# EAGLE design testBoard (EAGLE 9.2.2)

## Sheet 1 of 3
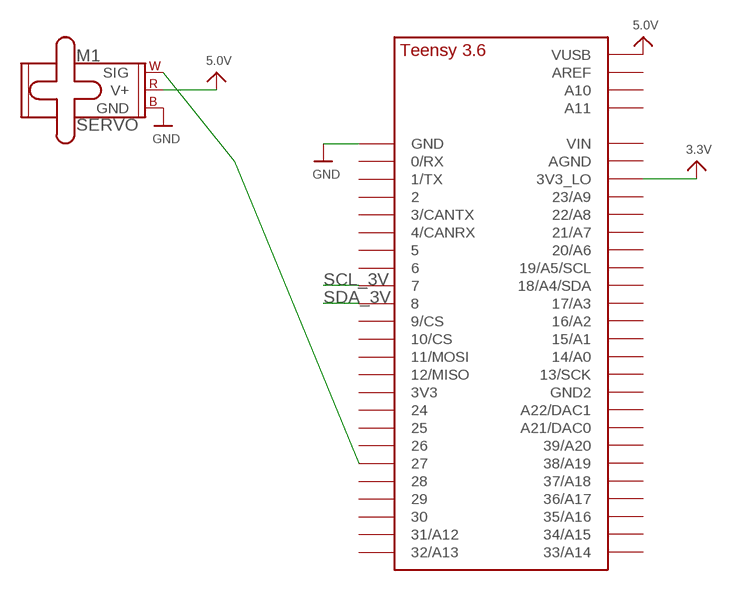
[diagram p0: schematic, sheet 1]

### Parts
M1  SERVO  [1X03]
U$69  TEENSY_3.5/3.6_BASIC  [TEENSY_3.5/3.6_BASIC]

### Nets
3.3V: U$69.3V3_LO ; also sheet 3
5.0V: M1.2(V+) U$69.VUSB ; also sheet 2
GND: M1.3(GND) U$69.GND ; also sheet 2,3
N$18: M1.1(SIG) U$69.27
SCL_3V: U$69.7 ; also sheet 3
SDA_3V: U$69.8 ; also sheet 3
Unconnected: U$69.0/RX U$69.1/TX U$69.2 U$69.3/CANTX U$69.3V3 U$69.4/CANRX U$69.5 U$69.6 U$69.9/CS U$69.10/CS U$69.11/MOSI U$69.12/MISO U$69.13/SCK U$69.14/A0 U$69.15/A1 U$69.16/A2 U$69.17/A3 U$69.18/A4/SDA U$69.19/A5/SCL U$69.20/A6 U$69.21/A7 U$69.21/DAC0(A21/DAC0) U$69.22/A8 U$69.23/A9 U$69.24 U$69.25 U$69.26 U$69.28 U$69.29 U$69.30 U$69.31/A12 U$69.32/A13 U$69.33/A14 U$69.34/A15 U$69.35/A16 U$69.36/A17 U$69.37/A18 U$69.38/A19 U$69.39/A20 U$69.A10 U$69.A11 U$69.A22/DAC1 U$69.AGND U$69.AREF U$69.GND2 U$69.VIN

## Sheet 2 of 3
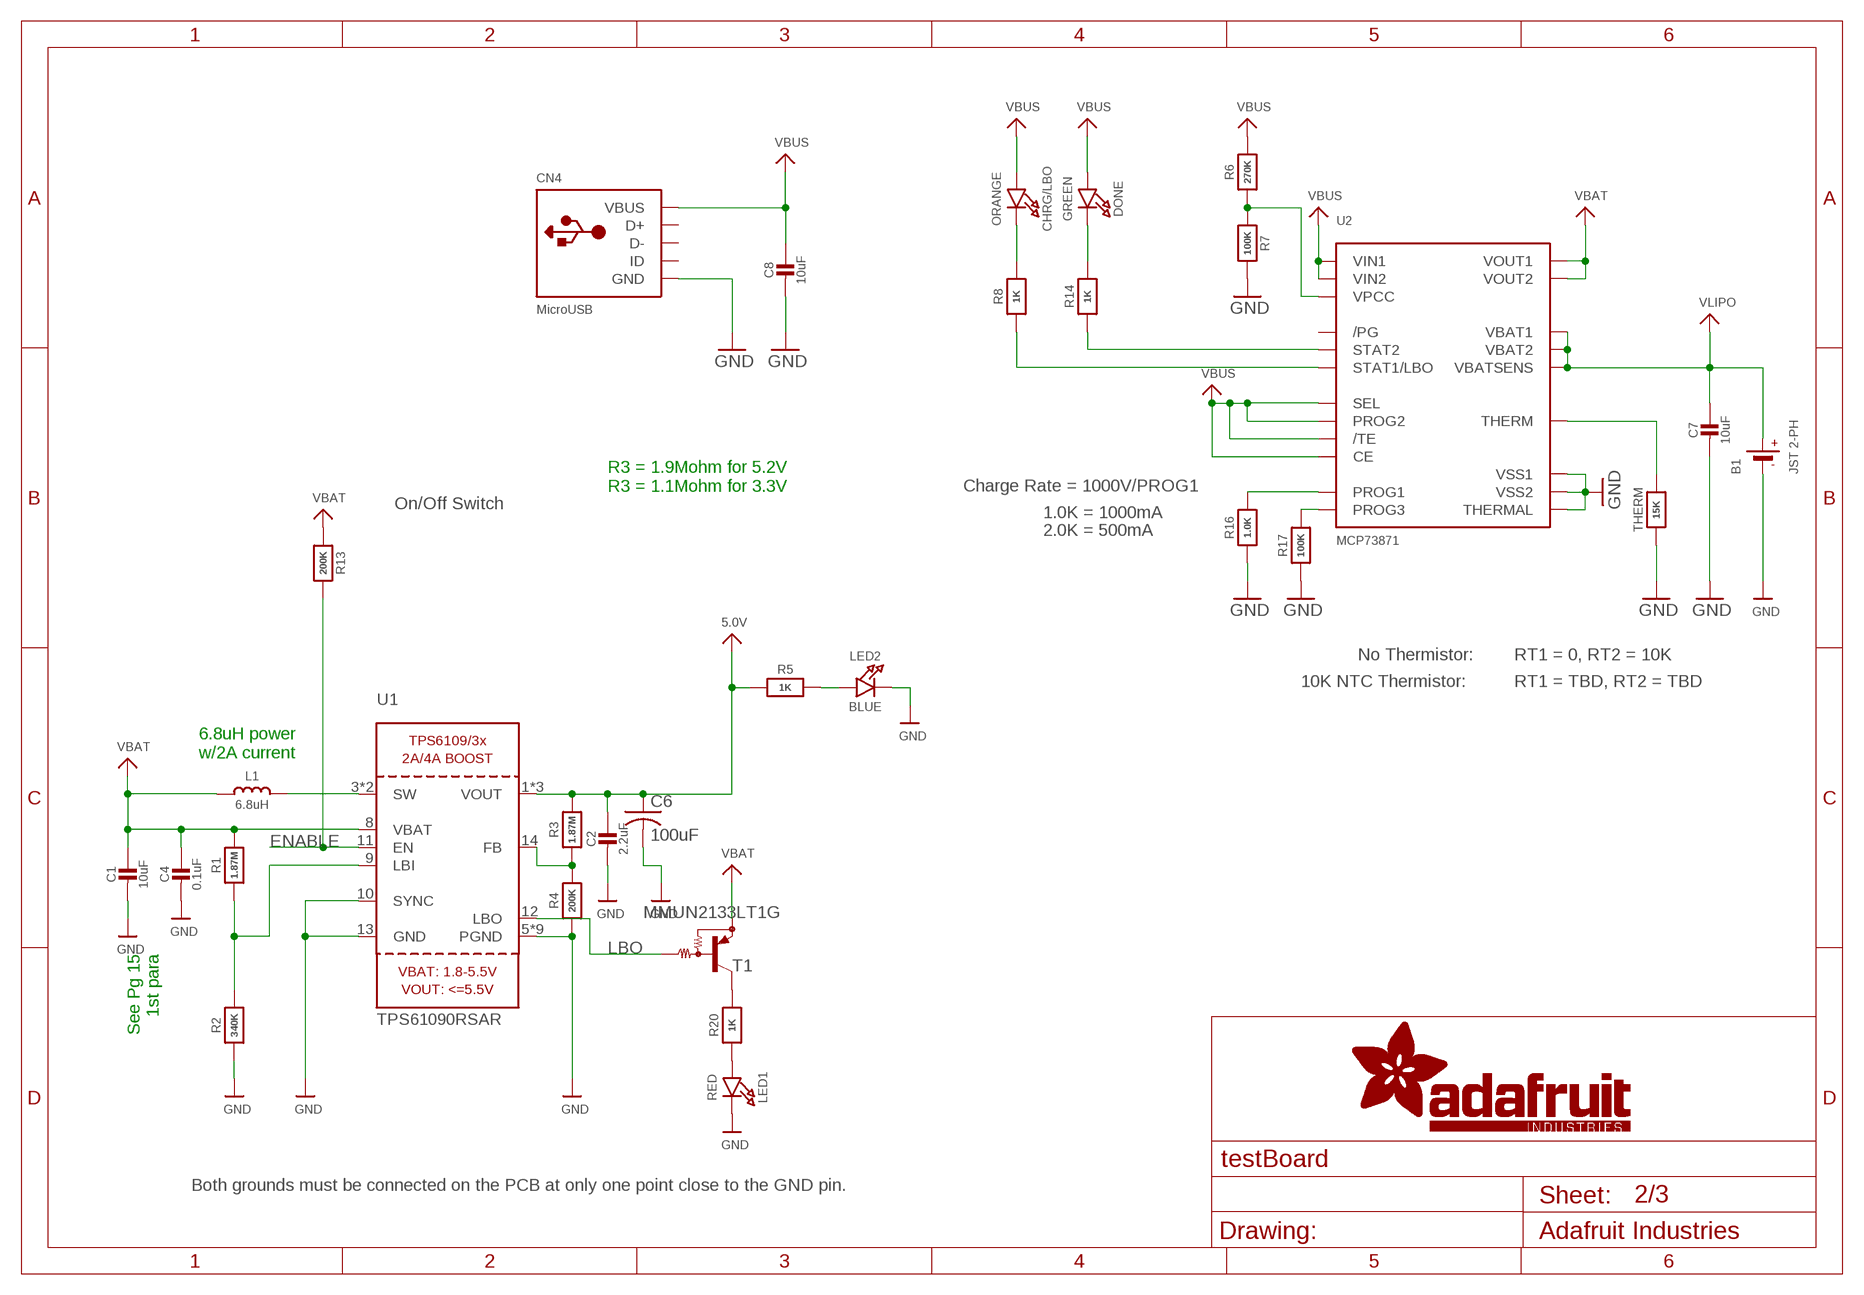
[diagram p1: schematic, sheet 2]

### Parts
B1  JST 2-PH  BATTERY  [JSTPH2]
C1  10uF  CAP_CERAMIC0805-NOOUTLINE  [0805-NO]
C2  2.2uF  CAP_CERAMIC0805-NOOUTLINE  [0805-NO]
C4  0.1uF  CAP_CERAMIC0805_10MGAP  [0805_10MGAP]
C6  100uF  C-USC1210  [C1210]
C7  10uF  CAP_CERAMIC0805-NOOUTLINE  [0805-NO]
C8  10uF  CAP_CERAMIC0805-NOOUTLINE  [0805-NO]
CHRG/LBO  ORANGE  LED0805_NOOUTLINE  [CHIPLED_0805_NOOUTLINE]
CN4  MicroUSB  USBMICRO_20329  [4UCONN_20329]
DONE  GREEN  LED0805_NOOUTLINE  [CHIPLED_0805_NOOUTLINE]
L1  6.8uH  INDUCTORTDK_VLC5045  [INDUCTOR_5X5MM_TDK_VLC5045]
LED1  RED  LED0805_NOOUTLINE  [CHIPLED_0805_NOOUTLINE]
LED2  BLUE  LED0805_NOOUTLINE  [CHIPLED_0805_NOOUTLINE]
R1  1.87M  RESISTOR_0805MP  [_0805MP]
R2  340K  RESISTOR_0805MP  [_0805MP]
R3  1.87M  RESISTOR0805_NOOUTLINE  [0805-NO]
R4  200K  RESISTOR0805_NOOUTLINE  [0805-NO]
R5  1K  RESISTOR0805_NOOUTLINE  [0805-NO]
R6  270K  RESISTOR0805_NOOUTLINE  [0805-NO]
R7  100K  RESISTOR0805_NOOUTLINE  [0805-NO]
R8  1K  RESISTOR0805_NOOUTLINE  [0805-NO]
R13  200K  RESISTOR0805_NOOUTLINE  [0805-NO]
R14  1K  RESISTOR0805_NOOUTLINE  [0805-NO]
R16  1.0K  RESISTOR0805_NOOUTLINE  [0805-NO]
R17  100K  RESISTOR0805_NOOUTLINE  [0805-NO]
R20  1K  RESISTOR0805_NOOUTLINE  [0805-NO]
T1  MMUN2133LT1G  MUN2114T1-PNP_DRIVER-SC59-BEC  [SC59-BEC]
THERM  15K  RESISTOR0805_NOOUTLINE  [0805-NO]
U1  TPS61090RSAR  VREG_TPS6103X  [PVQFN-16]
U2  MCP73871  [QFN20_4MM]

### Nets
5.0V: C2.1 C6.1 R3.2 R5.1 U1.1(VOUT) U1.15(VOUT) U1.16(VOUT) ; also sheet 1
ENABLE: R13.2 U1.11(EN)
GND: B1.1(-) C1.2 C2.2 C4.2 C6.2 C7.2 C8.2 CN4.BASE@1(GND) CN4.BASE@2(GND) CN4.GND CN4.SPRT@1(GND) CN4.SPRT@2(GND) CN4.SPRT@3(GND) CN4.SPRT@4(GND) LED1.C LED2.C R2.1 R4.1 R7.2 R16.1 R17.1 THERM.1 U1.5(PGND) U1.6(PGND) U1.7(PGND) U1.10(SYNC) U1.13(GND) U1.P$18(PGND) U1.P$19(PGND) U1.P$20(PGND) U1.P$21(PGND) U1.P$22(PGND) U1.THERMAL(PGND) U2.P$10(VSS1) U2.P$11(VSS2) U2.P$21(THERMAL) ; also sheet 1,3
LBO: T1.B U1.12(LBO)
N$1: L1.P$2 U1.3(SW) U1.4(SW)
N$2: LED1.A R20.1
N$3: R1.1 R2.2 U1.9(LBI)
N$4: LED2.A R5.2
N$5: R3.1 R4.2 U1.14(FB)
N$6: R20.2 T1.C
N$7: R6.1 R7.1 U2.P$2(VPCC)
N$8: DONE.C R14.2
N$9: R14.1 U2.P$7(STAT2)
N$10: THERM.2 U2.P$5(THERM)
N$11: R8.1 U2.P$8(STAT1/LBO)
N$12: CHRG/LBO.C R8.2
N$13: R17.2 U2.P$12(PROG3)
N$16: R16.2 U2.P$13(PROG1)
VBAT: C1.1 C4.1 L1.P$1 R1.2 R13.1 T1.E U1.8(VBAT) U2.P$1(VOUT1) U2.P$20(VOUT2)
VBUS: C8.1 CHRG/LBO.A CN4.VBUS DONE.A R6.2 U2.P$3(SEL) U2.P$4(PROG2) U2.P$9(/TE) U2.P$17(CE) U2.P$18(VIN1) U2.P$19(VIN2)
VLIPO: B1.2(+) C7.1 U2.P$14(VBAT1) U2.P$15(VBAT2) U2.P$16(VBATSENS)
Unconnected: CN4.D+ CN4.D- CN4.ID U2.P$6(/PG)

### Notes on the sheet
- R3 = 1.9Mohm for 5.2V
  R3 = 1.1Mohm for 3.3V
- Charge Rate = 1000V/PROG1
- On/Off Switch
- 1.0K = 1000mA
- 2.0K = 500mA
- No Thermistor: | RT1 = 0, RT2 = 10K
- 10K NTC Thermistor: | RT1 = TBD, RT2 = TBD
- 6.8uH power
  w/2A current
- See Pg 15
  1st para
- Both grounds must be connected on the PCB at only one point close to the GND pin.

## Sheet 3 of 3
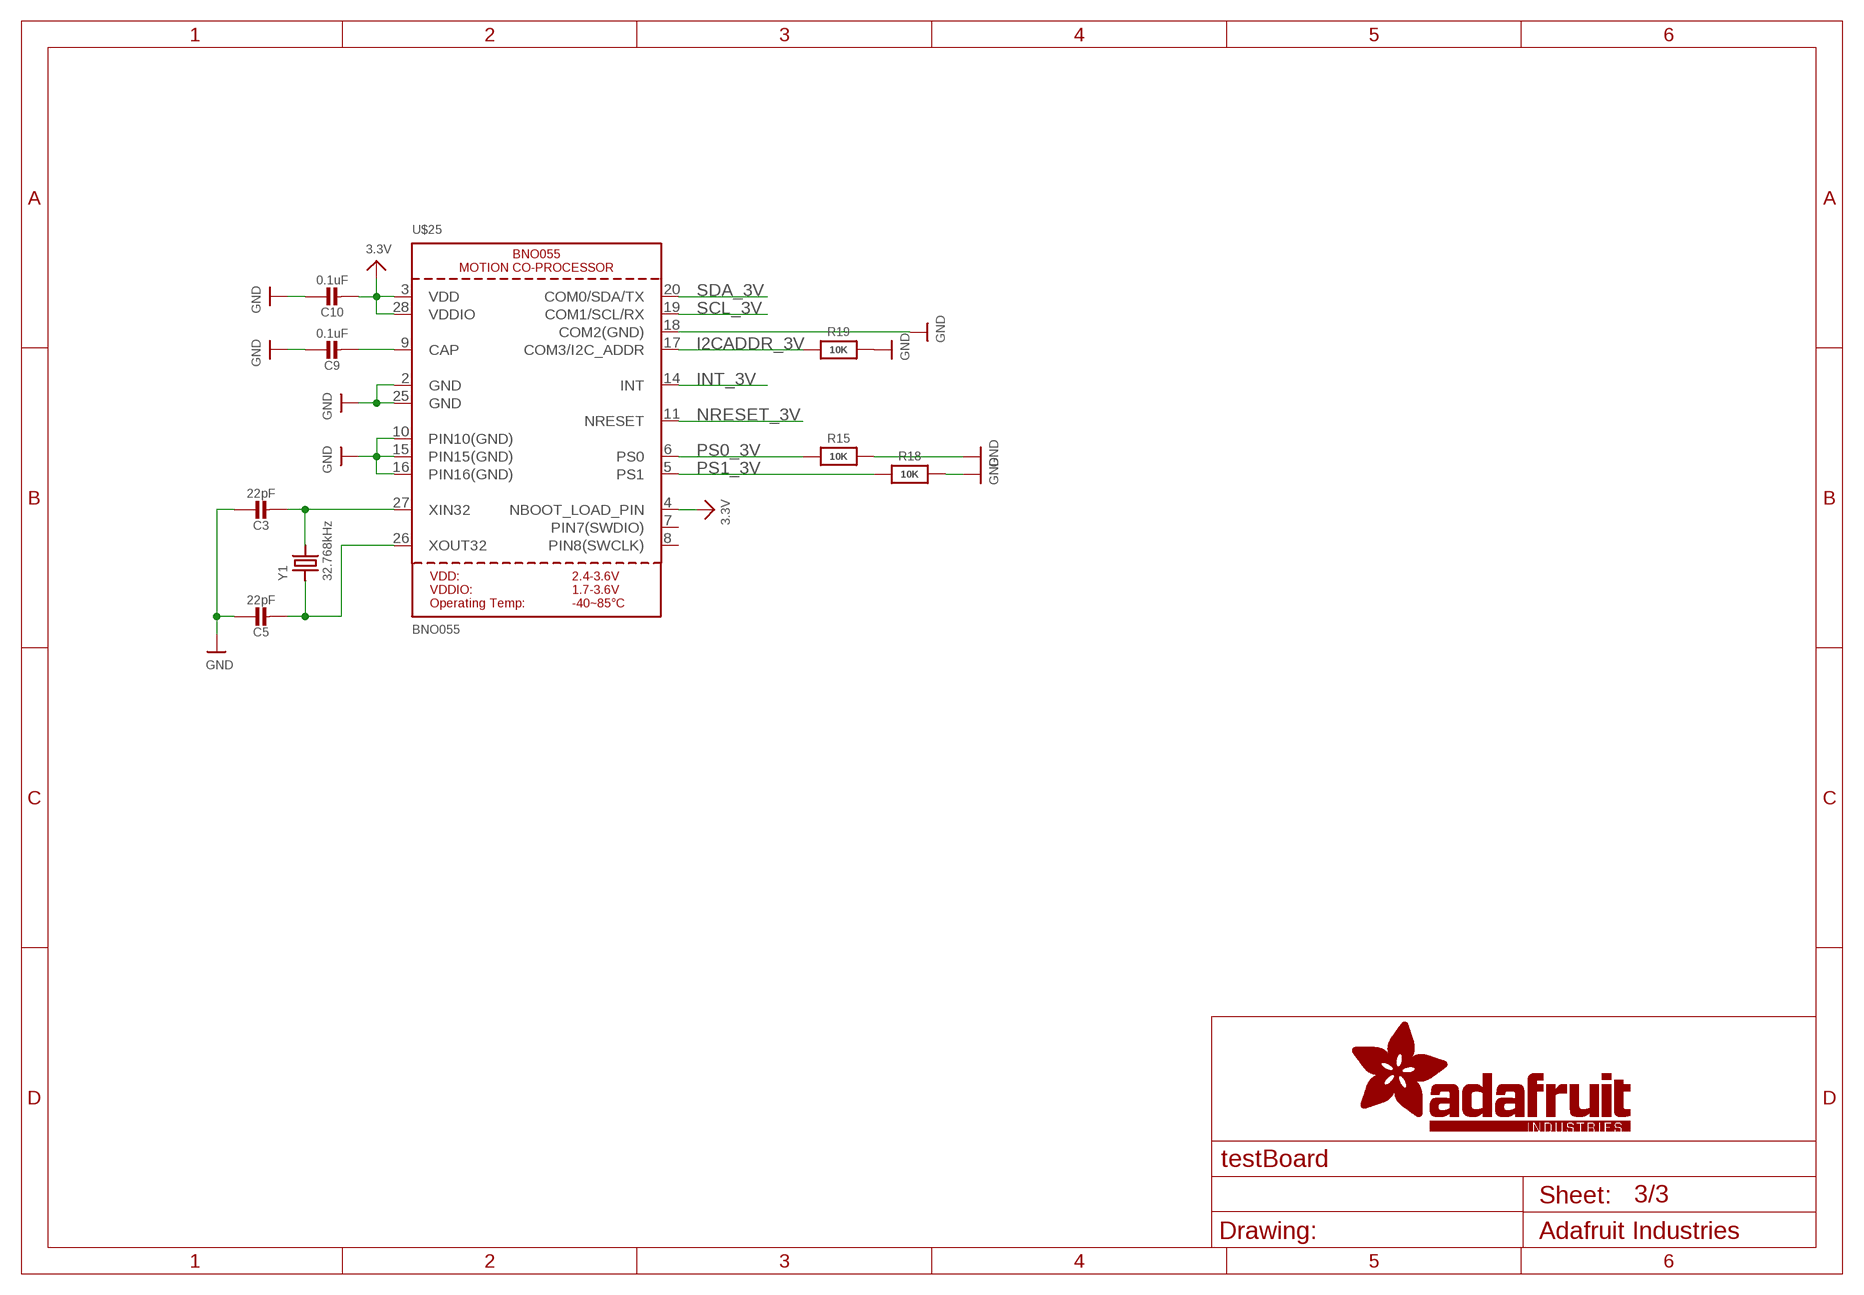
[diagram p2: schematic, sheet 3]

### Parts
C3  22pF  CAP_CERAMIC0805-NOOUTLINE  [0805-NO]
C5  22pF  CAP_CERAMIC0805-NOOUTLINE  [0805-NO]
C9  0.1uF  CAP_CERAMIC0805-NOOUTLINE  [0805-NO]
C10  0.1uF  CAP_CERAMIC0805_10MGAP  [0805_10MGAP]
R15  10K  RESISTOR0805_NOOUTLINE  [0805-NO]
R18  10K  RESISTOR0805_NOOUTLINE  [0805-NO]
R19  10K  RESISTOR0805_NOOUTLINE  [0805-NO]
U$25  BNO055  [BNO055]
Y1  32.768kHz  CRYSTAL8.0X3.8  [CRYSTAL_8X3.8]

### Nets
3.3V: C10.2 U$25.3(VDD) U$25.4(NBOOT_LOAD_PIN) U$25.28(VDDIO) ; also sheet 1
GND: C3.1 C5.1 C9.1 C10.1 R15.2 R18.2 R19.2 U$25.2(GND) U$25.10(PIN10(GND)) U$25.15(PIN15(GND)) U$25.16(PIN16(GND)) U$25.18(COM2(GND)) U$25.25(GND) ; also sheet 1,2
I2CADDR_3V: R19.1 U$25.17(COM3/I2C_ADDR)
INT_3V: U$25.14(INT)
N$14: C3.2 U$25.27(XIN32) Y1.P$4
N$15: C5.2 U$25.26(XOUT32) Y1.P$1
N$17: C9.2 U$25.9(CAP)
NRESET_3V: U$25.11(NRESET)
PS0_3V: R15.1 U$25.6(PS0)
PS1_3V: R18.1 U$25.5(PS1)
SCL_3V: U$25.19(COM1/SCL/RX) ; also sheet 1
SDA_3V: U$25.20(COM0/SDA/TX) ; also sheet 1
Unconnected: U$25.7(PIN7(SWDIO)) U$25.8(PIN8(SWCLK))

## Library data of the parts
B1 = microbuilder:BATTERY: CR1220 SMT - Digikey: 3001K-ND CD2032 BAT-HLD-001 - Digikey: BAT-HLD-001-ND
C1-C5 C7-C10 = microbuilder:CAP_CERAMIC: Ceramic Capacitors For new designs, use the packages preceded by an '_' character since they are more reliable: The following footprints should be used on most boards: _0402 - Standard footprint for regular board layouts _0603 - Standard footprint for regular board layouts _0805 - Standard footprint for regular board layouts _1206 - Standard footprint for regular board layouts For extremely tight-pitch boards where space is at a premium, the following 'micro-pitch' footprints can be used (smaller pads, no silkscreen outline, etc.): _0402MP - Micro-pitch footprint for very dense/compact boards _0603MP - Micro-pitch footprint for very dense/compact boards _0805MP - Micro-pitch footprint for very dense/compact boards _1206MP - Micro-pitch footprint for very dense/compact boards
C6 = rcl:C-US: CAPACITOR, American symbol
CHRG/LBO DONE LED1 LED2 = microbuilder:LED: LED 0603 - 0603 Surface Mount Package 2mA: Green LED - Low Power (3.9mcd, 2ma, 1.7Vf) - Digikey: 475-2709-2-ND Orange LED - Low Power (9.8mcd, 2ma, 1.8Vf) - Digikey: 475-1194-2-ND Red LED - Low Power (5mcd, 2ma, 1.8Vf) - Digikey: 475-1195-2-ND Yellow LED - Low Power (7mcd, 2ma, 1.8Vf) - Digikey: 475-1196-2-ND 5mA: Blue LED - Low Power (17mcd, 5ma, 2.9Vf) - Digikey: LNJ937W8CRACT-ND 0805 - 0805 Surface Mount Package 2mA: Red LED (8.8mcd, 2mA, 1.8Vf, Clear) - Low Power [Digikey: 475-2510-1-ND] Green LED (5mcd, 2mA, 1.8Vf, Clear) - Low Power [Digikey: 475-2730-1-ND] Yellow LED (11.3mcd, 2mA, 1.8Vf, Clear) - Low Power [Digikey: 475-2555-1-ND] 20mA: Red LED (104mcd, 20mA, Diffused) - LS R976 [Digikey: 475-1278-6-ND] Red LED (12mcd, 20mA, 2.0Vf, Clear) - APT2012EC [Digikey: 754-1128-1-ND] Green LED (15mcd, 20mA, 2.2Vf, Clear) - APT2012GC [Digikey: 754-1131-1-ND] Orange LED (160mcd, 20mA, 2.1Vf, Clear) - APT2012SECK [Digikey: 754-1130-1-ND] 1206 - 1206 Surface Mount Package Green LED (26mcd, 20mA, Diffused) - LG N971 [Digikey: 475-1407-6-ND] Red LED (15mcd, 20mA, Diffused) - LH N974 [Digikey: 475-1416-6-ND] Cree - Cree High-Power Surface Mount LEDs XPEBWT-L1-0000-00D50 - White 111lm 350mA 2.9Vf 6200K 110° XTEAWT-00-0000-00000LEE3 - White 114lm 350mA 2.85Vf 5000K 115° Everlight - Everlight 45-21 Series Surface Mount LEDs 45-21/QK2C-B2832AC2CB2/2T - Warm White 2000mcd 20mA 3.25Vf 3050K 120° 45-21/LK2C-B38452C4CB2/2T - Nuetral White 2000mcd 20mA 3.25Vf 4150K 120° 45-21/LK2C-B50634C6CB2/2T - Cold White 2200mcd 20mA 3.25Vf 5650K 120° PLCC2 Reverse Mount LS T77K-J1L2-1-0-2-R18-Z - Red 11.25mcd 2mA 1.8Vf 630nm 120° LO T77K-L1M2-24-Z - Orange 19.6mcd 2mA 1.8Vf 606nm 120° LY T77K-K2M1-26-Z - Yellow 15.7mcd 2mA 1.8Vf 587nm 120°
CN4 = microbuilder:USB: USB Connectors USBMINIB - Surface Mount Female Mini-B USB Connector 4UConnector: 06564
L1 = microbuilder:INDUCTOR: Inductors 0603: 10nH Ceramic Inductor - microwire antenna/RF (Digikey: 712-1434-2-ND) 0805: 560nH Ceramic Inductor - RF (Digikey: 553-1047-1-ND) 270nH Ceramic Inductor - Q = 40@250MHz, +-5%, 1 Ohm DC Resistance (Digikey: 535-10506-2-ND) 1007 (2518 Metric) SMT: 10µH 10% 250mOhm 820mA 1007 Inductor (Digikey: 587-2189-1-ND) 22µH 10% 500mOhm 580mA 1007 Inductor (Digikey: 587-2190-1-ND) 47µH 10% 950mOhm 420mA 1007 Inductor (Digikey: 587-2191-1-ND) 47µH 5% 100mOhm 1A 1008 Inductor (Digikey: 732-1816-1-ND) 5.0x5.0mm (Taiyo Yuden NR5040 Series) 6.8µH 20% 2.3A 64mOhm Inductor (Digikey: 587-2374-2-ND) 5.0x5.0mm (TDK VLC5045 Series) 4.7µH 20% 3.3A 34mOhm Inductor (Digikey: 445-6526-1-ND) 6.8µH 20% 2.7A 46mOhm Inductor (Digikey: 445-6527-1-ND) 6.0x6.0mm (TDK VLC6045 Series) 4.7µH 20% 3.8A 27mOhm Inductor (Digikey: 445-6538-2-ND) 6.8µH 20% 3A 41mOhm Inductor (Digikey: 445-6540-1-ND) 6.2µH 30% 2.2A 45mOhm Inductor (Digikey: SRR5028-6R2YCT-ND) - Not TDK VLC6045 but footprint should match 6.0x6.0mm (TDK SLF6045 Series) 6.8uH 30% 2A 33mOhm Inductor (Digikey: 445-4572-1-ND, Mouser: 810-SLF645T6R8N2R0PF) 6.0x6.0mm (Sumida CDRH5D28 Series) 6.2uH 30% 1.8A 45mOhm Inductor (Digikey: 308-1542-1-ND) Taiyo Yuden NR3015T2R2M - 2.2uH 20% 1.5A (Digikey: 587-1648-2-ND, Mouser: 963-NR3015T2R2M) - Used with TI TPS62172 CoilCraft RFID Transponder Coil - MA5532-AE (For use with AS3935 Lightning Sensor) Vishay IHLP 1.0uH Molded Inductor - 24mOhm DCR, 5A, +/-20%, -55°C-125°C (Digikey: 541-1319-1-ND)
M1 = SparkFun-Electromechanical:SERVO: Servo Motor 3-pin connector for a standard servo motor (voltage supply, ground, and control signal.) SparkFun Products Servo - Generic (Sub-Micro Size) <https://www.sparkfun.com/products/9065> (ROB-09065) Servo - Generic High Torque Continuous Rotation (Standard Size) <https://www.sparkfun.com/products/9347> (ROB-09347) Servo - Generic High Torque (Standard Size) <https://www.sparkfun.com/products/11965> (ROB-11965)
R1-R8 R13-R20 THERM = microbuilder:RESISTOR: Resistors For new designs, use the packages preceded by an '_' character since they are more reliable: The following footprints should be used on most boards: _0402 - Standard footprint for regular board layouts _0603 - Standard footprint for regular board layouts _0805 - Standard footprint for regular board layouts _1206 - Standard footprint for regular board layouts For extremely tight-pitch boards where space is at a premium, the following 'micro-pitch' footprints can be used (smaller pads, no silkscreen outline, etc.): _0402MP - Micro-pitch footprint for very dense/compact boards _0603MP - Micro-pitch footprint for very dense/compact boards _0805MP - Micro-pitch footprint for very dense/compact boards _1206MP - Micro-pitch footprint for very dense/compact boards
T1 = transistor:*-PNP_DRIVER-: PNP Bias Resistor Transistor
U1 = microbuilder:VREG_TPS6103X: TPS6103x 4A Boost - 1.8-5.5V Input, Adjustable Output to 5.5V
U2 = microbuilder:MCP73871: MCP73871 Lithium Polymer Battery Charger Digikey: MCP73871-2CCI/ML-ND
U$25 = microbuilder:BNO055: BNO055 - Motion Co-Processor
U$69 = Teensy356:TEENSY_3.5/3.6_BASIC
Y1 = microbuilder:CRYSTAL: Crystals HC49UP - Surface Mount Crystal 4.0MHz 18pF +/-30ppm Surface Mount Crystal [Digikey: 535-9857-1-ND] 12.0 MHz Surface Mount Crystal [Digikey: 535-9869-6-ND] 25.0 MHz Surface Mount Crystal [Digikey: 535-9078-1-ND] 2.5 x 2.0mm - MEMs SMT Crystal 16.0 MHz 10pF 20ppm 2.5 x 2.0mm Crystal [Digikey -40-85°C: 535-10923-1-ND] 3.2 x 2.5mm - MEMs SMT Crystal 12.0 MHz 8pF 15ppm 3.2 x 2.5mm Crystal [Digikey: -10-70°C: 644-1047-1-ND -40-125°C: 644-1128-1-ND] 40~85°C cheaper: 644-1173-6-ND 16.0 MHz 8pF 15ppm 3.2 x 2.5mm Crystal [Digikey: -10-70°C: 644-1049-1-ND -40-125°C: 644-1129-2-ND]-40~85°C cheaper: 644-1175-6-ND 16.0 MHz 10pF 10ppm 3.2 x 2.5mm Crystal [Digikey: 644-1100-1-ND] 27.12 MHz 18pF 30ppm 3.2 x 2.5mm Crystal [Digikey: 887-1424-1-ND] 27.12MHz 10pF 10ppm 3.2 x 2.5mm Crystal [Digikey: 887-1329-1-ND] 4.9 x 1.8mm - MEMs SMT Crystal 32.768 KHz 12.5pF 20ppm 4.9 x 1.8mm Crystal [Digikey: SE2415CT-ND] 8.0 x 3.8mm - Surface Mount Crystal 32.768kHz 12.5pF 20ppm -40°C-85°C [Digikey: 535-9166-2-ND] Cylinder 32.768KHz Cylinder Crystal (2x6mm body) [Ex. Digikey: 300-8341-2-ND]

## Board
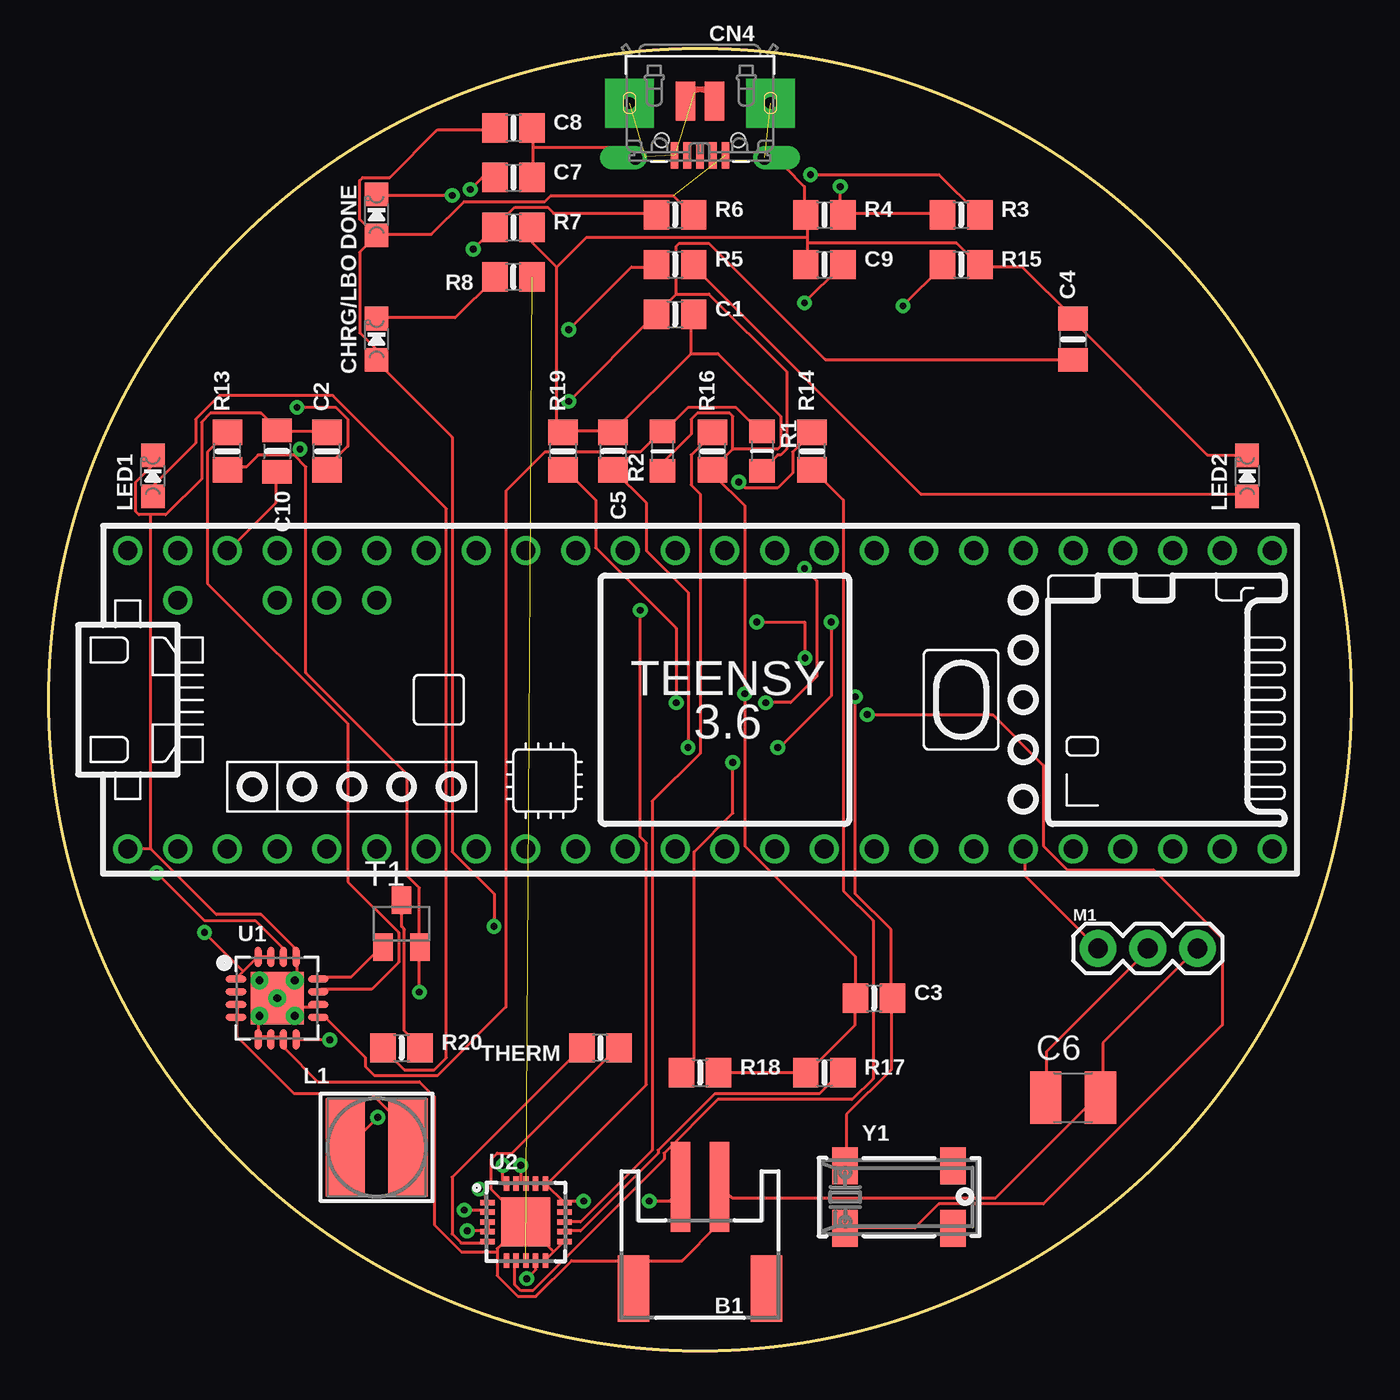
[diagram p3: board, top side]
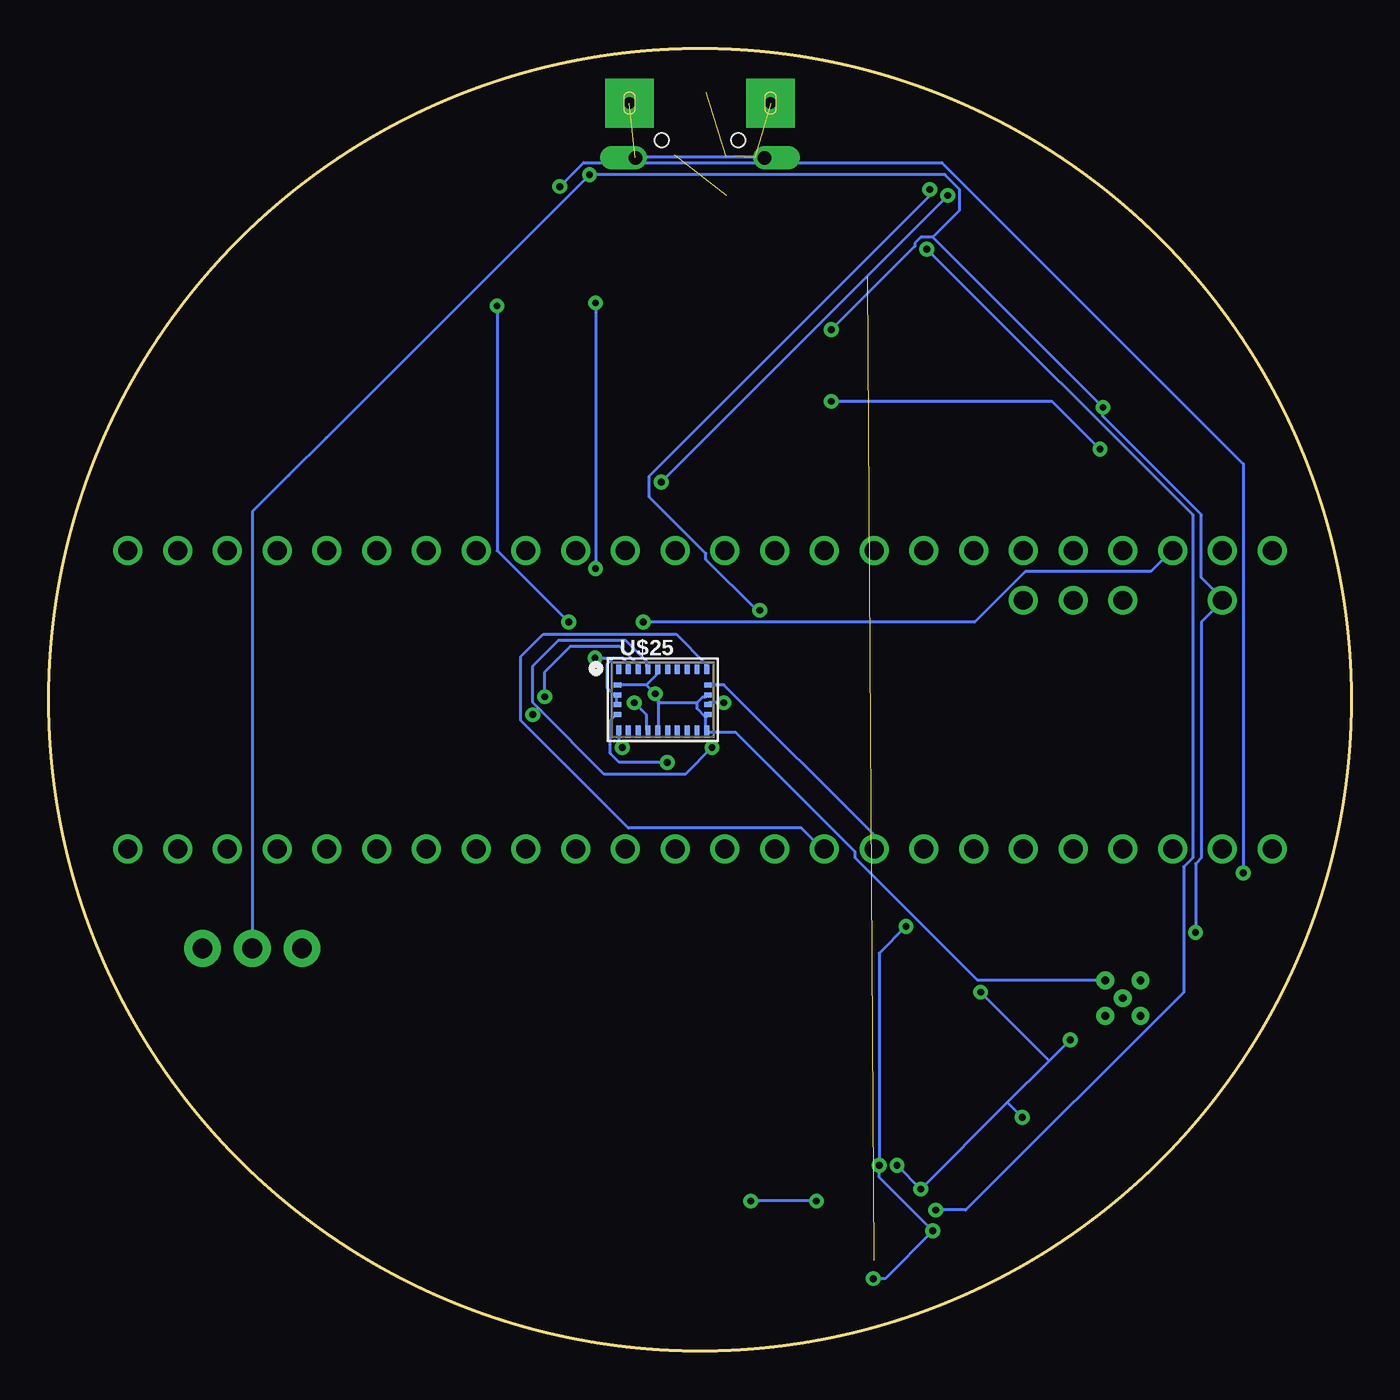
[diagram p4: board, bottom side, seen from below]

Size 66.48 x 66.48 mm. Coordinates in mm from the lower left corner, seen from the top.
Outline: circle at 33.24,33.24 radius 33.24
Copper layers (1*16): Top 0.035mm / dielectric 1.5mm / Bottom 0.035mm
Design rules "default": minimum track width 6mil, minimum drill 0.35mm, track to track 6mil, track to pad 6mil, pad to pad 6mil, via to via 6mil, smd to smd 6mil, copper to edge 40mil, drill to drill 6mil, minimum pad ring 10mil, minimum via ring 8mil, stop-mask expansion 4mil, vias tented up to drill 0mil, thermal gap 10mil

### Footprints (pad centres in the part's own frame; a part is rotated, then mirrored left to right if it is on the bottom)
JSTPH2 = smd 1 x 4.6: 1 -1,-3.7; 2 1,-3.7 | smd 1.6 x 3.4: NC1 -3.4,1.5; NC2 3.4,1.5
0805-NO = smd 1.3 x 1.5: 1 -0.95,0; 2 0.95,0
0805_10MGAP = smd 1.2 x 1.5: 1 -1.05,0; 2 1.05,0
C1210 = smd 1.6 x 2.7: 1 -1.4,0; 2 1.4,0
CHIPLED_0805_NOOUTLINE = smd 1.2 x 1.2: A 0,-1.05; C 0,1.05
4UCONN_20329 = smd 1 x 2: BASE@1 -0.75,-2; BASE@2 0.75,-2 | smd 0.4 x 1.35: D+ 0,0.775; D- -0.65,0.775; GND 1.3,0.775; ID 0.65,0.775; VBUS -1.3,0.775 | drill 0.7 offset: SPRT@1 -3.3,0.9; SPRT@2 3.3,0.9 | drill 0.6 pad 2.5 square: SPRT@3 -3.6,-1.9; SPRT@4 3.6,-1.9 | hole 0.7: -1.95,0; 1.95,0
INDUCTOR_5X5MM_TDK_VLC5045 = smd 2 x 5: P$1 -1.6,0; P$2 1.6,0
1X03 = drill 1.016 pad 1.88: 1 0,0; 2 2.54,0; 3 5.08,0
_0805MP = smd 1.2 x 1.3: 1 -1.016,0; 2 1.016,0
SC59-BEC = smd 1 x 1.4: B -0.95,-1.2; C 0,1.2; E 0.95,-1.2
PVQFN-16 = smd 1.05 x 0.35: 1 -2.1,0.975; 2 -2.1,0.325; 3 -2.1,-0.325; 4 -2.1,-0.975; 9 2.1,-0.975; 10 2.1,-0.325; 11 2.1,0.325; 12 2.1,0.975 | smd 0.35 x 1.05: 5 -0.975,-2.1; 6 -0.325,-2.1; 7 0.325,-2.1; 8 0.975,-2.1; 13 0.975,2.1; 14 0.325,2.1; 15 -0.325,2.1; 16 -0.975,2.1 | drill 0.4: P$18 0,0; P$19 -0.9,0.9; P$20 0.9,0.9; P$21 0.9,-0.9; P$22 -0.9,-0.9 | smd 2.7 x 2.7: THERMAL 0,0
QFN20_4MM = smd 0.73 x 0.28: P$1 -1.965,1; P$2 -1.965,0.5; P$3 -1.965,0; P$4 -1.965,-0.5; P$5 -1.965,-1; P$11 1.965,-1; P$12 1.965,-0.5; P$13 1.965,0; P$14 1.965,0.5; P$15 1.965,1 | smd 0.28 x 0.73: P$6 -1,-1.965; P$7 -0.5,-1.965; P$8 0,-1.965; P$9 0.5,-1.965; P$10 1,-1.965; P$16 1,1.965; P$17 0.5,1.965; P$18 0,1.965; P$19 -0.5,1.965; P$20 -1,1.965 | smd 2.5 x 2.5: P$21 0,0
BNO055 = smd 0.25 x 0.475: 1 -2.25,1.562; 6 -2.25,-1.562; 7 -1.75,-1.562; 8 -1.25,-1.562; 9 -0.75,-1.562; 10 -0.25,-1.562; 11 0.25,-1.562; 12 0.75,-1.562; 13 1.25,-1.562; 14 1.75,-1.562; 15 2.25,-1.562; 20 2.25,1.562; 21 1.75,1.562; 22 1.25,1.562; 23 0.75,1.562; 24 0.25,1.562; 25 -0.25,1.562; 26 -0.75,1.562; 27 -1.25,1.562; 28 -1.75,1.562 | smd 0.375 x 0.25: 2 -2.312,0.75; 3 -2.312,0.25; 4 -2.312,-0.25; 5 -2.312,-0.75; 16 2.312,-0.75; 17 2.312,-0.25; 18 2.312,0.25; 19 2.312,0.75
TEENSY_3.5/3.6_BASIC = drill 0.965: 0/RX -25.4,-7.62; 1/TX -22.86,-7.62; 2 -20.32,-7.62; 3/CANTX -17.78,-7.62; 3V3 7.62,-7.62; 3V3_LO -22.86,7.62; 4/CANRX -15.24,-7.62; 5 -12.7,-7.62; 6 -10.16,-7.62; 7 -7.62,-7.62; 8 -5.08,-7.62; 9/CS -2.54,-7.62; 10/CS 0,-7.62; 11/MOSI 2.54,-7.62; 12/MISO 5.08,-7.62; 13/SCK 5.08,7.62; 14/A0 2.54,7.62; 15/A1 0,7.62; 16/A2 -2.54,7.62; 17/A3 -5.08,7.62; 18/A4/SDA -7.62,7.62; 19/A5/SCL -10.16,7.62; 20/A6 -12.7,7.62; 21/A7 -15.24,7.62; 21/DAC0 12.7,7.62; 22/A8 -17.78,7.62; 23/A9 -20.32,7.62; 24 10.16,-7.62; 25 12.7,-7.62; 26 15.24,-7.62; 27 17.78,-7.62; 28 20.32,-7.62; 29 22.86,-7.62; 30 25.4,-7.62; 31/A12 27.94,-7.62; 32/A13 30.48,-7.62; 33/A14 30.48,7.62; 34/A15 27.94,7.62; 35/A16 25.4,7.62; 36/A17 22.86,7.62; 37/A18 20.32,7.62; 38/A19 17.78,7.62; 39/A20 15.24,7.62; A10 -17.78,5.08; A11 -15.24,5.08; A22/DAC1 10.16,7.62; AGND -25.4,7.62; AREF -20.32,5.08; GND -27.94,-7.62; GND2 7.62,7.62; VIN -27.94,7.62; VUSB -25.4,5.08
CRYSTAL_8X3.8 = smd 1.3 x 1.9: P$1 -2.75,-1.6; P$2 2.75,-1.6; P$3 2.75,1.6; P$4 -2.75,1.6

### Placement (x,y rotation side)
B1  33.24,4.66 180 top
C1  31.97,52.92 0 top
C2  14.19,45.94 90 top
C3  42.13,18 0 top
C4  52.29,51.65 90 top
C5  28.79,45.94 270 top
C6  52.29,12.92 0 top
C7  23.71,59.91 0 top
C8  23.71,62.45 0 top
C9  39.59,55.46 0 top
C10  11.65,45.94 270 top
CHRG/LBO  16.73,51.65 0 top
CN4  33.24,61.81 180 top
DONE  16.73,58 0 top
L1  16.73,10.38 0 top
LED1  5.3,44.67 0 top
LED2  61.18,44.67 0 top
M1  53.56,20.54 0 top
R1  36.41,45.94 270 top
R2  31.33,45.94 90 top
R3  46.57,58 0 top
R4  39.59,58 0 top
R5  31.97,55.46 0 top
R6  31.97,58 0 top
R7  23.71,57.37 0 top
R8  23.71,54.83 180 top
R13  9.11,45.94 90 top
R14  38.95,45.94 90 top
R15  46.57,55.46 0 top
R16  33.87,45.94 90 top
R17  39.59,14.19 0 top
R18  33.24,14.19 0 top
R19  26.25,45.94 90 top
R20  18,15.46 0 top
T1  18,21.81 0 top
THERM  28.16,15.46 180 top
U1  11.65,18 0 top
U2  24.35,6.57 0 top
U$25  35.14,33.24 0 bottom
U$69  31.97,33.24 0 top
Y1  43.4,7.84 0 top

### Tracks (layer width: path | path; a pad name or v marks a point on that pad's centre or on a via)
3.3V  (via drill 0.35)
  Top 0.152: v36.14,37.2 38.6,37.2 v38.6,35.37 | C10.2 11.6,44.82 11.6,43.3 9.16,40.86 U$69.3V3_LO
  Bottom 0.152: 37.51,33.39 37.51,33.09 U$25.4 | 37.66,35.37 37.2,35.37 36.9,35.07 36.9,34.92 U$25.28 | 37.66,35.37 37.96,35.07 37.96,33.85 37.51,33.39 | 37.51,33.39 U$25.3 | v38.6,35.37 37.66,35.37 | v36.14,37.2 19.22,37.2 16.63,39.79 10.23,39.79 9.16,40.86 U$69.3V3_LO
5.0V  (via drill 0.35)
  Top 0.152: C6.1 50.92,12.97 50.92,15.26 56.1,20.44 M1.2 | 9.92,19.37 10.53,19.98 U1.16 10.68,20.13 11.29,20.13 U1.15 | 9.92,19.37 9.62,19.07 U1.1 | v12.67,48.17 14.65,48.17 15.26,47.57 15.26,46.19 14.19,45.13 C2.1 | v26.53,52.14 29.73,55.34 30.95,55.34 R5.1 | v38.88,60.06 45.43,60.06 47.41,58.08 R3.2 | v7.94,21.35 9.92,19.37
  Bottom 0.152: v26.53,52.14 22.27,56.4 22.27,56.56 21.96,56.86 21.35,56.86 | 21.35,56.86 v12.67,48.17 12.67,47.72 7.64,42.69 7.64,39.49 6.57,38.42 U$69.VUSB 6.57,38.27 7.64,37.2 7.64,25.16 7.94,24.86 v7.94,21.35 | 21.35,56.86 19.98,58.23 19.98,59.3 20.74,60.06 v38.88,60.06 52.33,46.61 54.23,44.71 56.1,42.84 M1.2
ENABLE
  Top 0.152: U1.11 13.88,18.46 16.48,18.46 17.85,19.83 17.85,21.35 15.26,23.94 15.26,32.02 8.09,39.18 8.09,45.89 9.01,46.8 R13.2
GND  (via drill 0.35)  (4 unrouted)
  Top 0.152: 24.71,61.43 24.71,62.35 C8.2 | 24.71,61.43 24.71,59.91 C7.2 | 24.71,61.43 29.7,61.43 CN4.SPRT@2 | 38.73,56.86 38.73,57.93 R4.1 38.57,58.08 38.57,59.45 37.59,60.44 CN4.SPRT@1 | 38.73,56.86 38.73,56.56 | 38.73,56.56 38.73,55.49 C9.1 | LED2.C 61.13,45.74 59.15,45.74 52.29,52.59 C4.2 52.29,52.75 49.7,55.34 47.57,55.34 R15.2 47.41,55.49 46.35,56.56 38.73,56.56 | R18.2 R17.1 38.73,14.19 41.16,16.63 41.16,18 | 34.92,46.04 34.92,47.72 34.76,47.87 33.09,47.87 32.78,47.57 32.78,46.8 31.41,45.43 31.41,44.97 R2.1 | 34.92,46.04 34,45.13 R16.1 34,44.97 34,44.67 35.53,43.15 v35.53,33.54 35.53,25.77 41.16,20.13 41.16,18 | 32.78,50.92 32.78,52.9 C1.2 | 32.78,50.92 28.82,46.96 C5.1 28.67,46.96 26.38,46.96 R19.2 26.23,46.96 25.92,47.26 25.92,55.34 | 25.92,55.34 24.71,56.56 24.71,57.32 R7.2 | 34.92,46.04 37.2,46.04 37.35,46.19 37.35,47.72 34.15,50.92 32.78,50.92 | 41.16,18 C3.1 | 38.73,56.86 27.45,56.86 25.92,55.34 | M1.3 53.81,15.71 53.81,12.97 C6.2 53.66,12.82 53.36,12.82 48.33,7.79 34.89,7.79 B1.1 34.15,8.27 34.15,6.42 32.33,4.59 26.69,4.59 24.86,2.76 23.94,2.76 22.88,3.83 22.88,5.05 | 25.77,5.05 26.23,5.5 U2.P$11 | 25.77,5.05 25.47,4.74 U2.P$10 | 24.25,6.57 25.77,5.05 | 24.25,6.57 22.57,8.25 22.57,9.77 22.88,10.07 23.64,10.07 28.97,15.41 THERM.1 | 22.88,5.05 22.88,5.2 24.25,6.57 | 24.25,6.57 U2.P$21 | 5.2,42.69 5.96,42.69 7.79,44.52 7.79,47.41 8.25,47.87 10.84,47.87 11.6,47.11 C10.1 11.75,46.96 14.19,46.96 C2.2 | 5.2,42.69 4.59,42.69 4.44,42.84 4.44,44.36 5.2,45.13 5.2,45.58 LED1.C | 10.68,16.02 11.29,16.02 U1.6 11.45,16.02 11.9,16.02 U1.7 12.06,15.87 12.06,15.41 13.73,13.73 18.91,13.73 19.68,12.97 19.68,6.42 21.05,5.05 22.88,5.05
  Top 0.152: 12.67,17.24 12.97,17.54 13.73,17.54 U1.10 | 12.67,18.91 12.67,19.98 U1.13 12.51,20.13 12.51,20.59 10.84,22.27 8.55,22.27 5.2,25.62 | 10.68,17.09 10.68,16.02 | 10.68,16.02 U1.5 | 10.68,17.09 U1.P$22 | 10.68,17.09 U1.THERMAL | 12.67,17.24 U1.P$21 | 12.67,17.24 U1.THERMAL | 11.75,18 U1.THERMAL | U1.P$19 10.84,18.76 11.6,18 U1.THERMAL | 12.67,18.91 U1.P$20 | 12.67,18.91 U1.THERMAL | 5.2,25.62 U$69.GND | 5.2,25.62 5.2,42.69 | CN4.BASE@2 32.95,64.28 33.85,64.48 32.63,64.48 33.53,64.28 CN4.BASE@1
  Bottom 0.152: CN4.SPRT@2 30.44,60.91 30.5,60.98 35.98,60.98 36.04,60.91 CN4.SPRT@1 | 32.93,32.33 32.93,31.72 U$25.15 32.78,31.56 31.41,31.56 25.31,25.47 25.31,25.16 19.07,18.91 12.67,18.91 U1.P$20 | 32.93,32.33 32.93,32.48 U$25.16 | 33.39,33.09 33.09,33.39 32.93,33.39 U$25.18 | 33.39,33.09 33.39,32.78 32.93,32.33 | 35.98,34 37.35,34 U$25.2 | 35.98,34 35.37,34.61 35.37,34.76 U$25.25 | 35.37,33.09 35.37,33.39 v35.53,33.54 35.98,34 | 35.37,33.09 35.37,31.72 U$25.10 | 35.37,33.09 33.39,33.09
I2CADDR_3V  (via drill 0.35)
  Top 0.152: v32.02,33.09 32.02,36.9 27.91,41.01 27.91,43.45 26.38,44.97 R19.1
  Bottom 0.152: v32.02,33.09 32.78,33.09 U$25.17
LBO
  Top 0.152: U1.12 13.88,19.07 15.41,19.07 16.93,20.59 T1.B
N$1
  Top 0.152: U1.3 9.62,17.54 9.62,17.09 U1.4 9.62,16.93 9.62,16.02 12.51,13.12 16.48,13.12 18.3,11.29 18.3,10.38 L1.P$2
N$2
  Top 0.152: LED1.A 5.35,43.76 5.35,44.21 7.48,46.35 7.48,47.57 8.7,48.78 14.49,48.78 20.29,42.99 20.29,14.95 19.68,14.34 18.15,14.34 17.09,15.41 R20.1
N$3
  Top 0.152: U1.9 13.88,16.93 14.19,16.93 16.17,14.95 16.17,14.49 16.63,14.04 19.83,14.04 23.33,17.54 23.33,43.91 25.31,45.89 30.19,45.89 31.26,46.96 R2.2 31.41,46.96 32.63,48.17 35.07,48.17 36.29,46.96 R1.1
N$4
  Top 0.152: LED2.A 61.13,43.76 44.52,43.76 32.93,55.34 R5.2
N$5  (via drill 0.35)
  Top 0.152: v5.5,24.4 7.94,21.96 10.53,21.96 11.9,20.59 11.9,20.13 U1.14 | v40.4,59.45 40.4,58.08 R4.2 40.55,58.08 45.58,58.08 R3.1
  Bottom 0.152: v5.5,24.4 5.5,45.28 20.9,60.67 39.18,60.67 v40.4,59.45
N$6
  Top 0.152: T1.C 18,21.66 18.15,21.5 18.15,16.32 18.91,15.56 R20.2
N$7  (via drill 0.35)
  Top 0.152: v21.2,7.18 22.27,7.18 U2.P$2 | v21.66,56.25 22.72,57.32 R7.1 22.88,57.47 23.79,58.39 25.47,58.39 25.77,58.08 30.95,58.08 R6.1
  Bottom 0.152: v21.2,7.18 19.68,7.18 8.55,18.3 8.55,24.71 8.09,25.16 8.09,42.69 v21.66,56.25
N$8  (via drill 0.35)
  Top 0.152: v20.59,59 16.78,59 DONE.C | v35.22,44.36 35.53,44.06 37.2,44.06 37.96,44.82 37.96,45.89 38.88,46.8 R14.2
  Bottom 0.152: v35.22,44.36 v20.59,59
N$9
  Top 0.152: U2.P$7 23.79,4.59 23.79,3.37 24.1,3.06 24.71,3.06 31.41,9.77 31.41,10.07 34.15,12.82 41.01,12.82 42.08,13.88 42.08,21.96 40.55,23.49 40.55,43.45 39.03,44.97 R14.1
N$10
  Top 0.152: U2.P$5 22.27,5.5 21.05,5.5 20.59,5.96 20.59,8.86 27.14,15.41 THERM.2
N$11  (1 unrouted)
N$12
  Top 0.152: CHRG/LBO.C 16.78,52.75 20.74,52.75 22.72,54.73 R8.2
N$13
  Top 0.152: U2.P$12 26.38,6.11 27.14,6.11 31.11,10.07 31.11,10.23 34,13.12 39.34,13.12 40.4,14.19 R17.2
N$14  (via drill 0.35)
  Top 0.152: v41.16,33.39 41.16,23.33 42.99,21.5 42.99,18 | 42.99,18 42.99,14.34 40.71,12.06 40.71,9.47 Y1.P$4 | 42.99,18 C3.2
  Bottom 0.152: v41.16,33.39 41.16,34.66 39.84,35.98 37.35,35.98 36.44,35.07 36.44,34.92 U$25.27
N$15  (via drill 0.35)
  Top 0.152: v32.63,30.8 32.63,38.73 30.5,40.86 30.5,43.3 28.82,44.97 C5.2 | v41.77,32.48 48.17,32.48 50.77,29.89 50.77,25.77 51.98,24.55 56.4,24.55 59.91,21.05 59.91,16.63 50.77,7.48 45.43,7.48 44.21,6.26 40.71,6.26 Y1.P$1
  Bottom 0.152: 41.47,32.78 38.12,29.43 34,29.43 v32.63,30.8 | 41.47,32.78 41.77,33.09 41.77,34.97 40.45,36.29 37.05,36.29 35.98,35.22 35.98,34.92 U$25.26 | 41.47,32.78 v41.77,32.48
N$16
  Top 0.152: U2.P$13 27.14,6.57 30.8,10.23 30.8,28.06 33.24,30.5 33.24,43.76 32.78,44.21 32.78,45.74 33.85,46.8 R16.2
N$17  (via drill 0.35)
  Top 0.152: v36.59,33.09 37.86,33.09 39.21,34.43 39.21,39.31 v38.57,39.95 | v38.57,53.51 40.4,55.34 C9.2
  Bottom 0.152: v36.59,33.09 35.98,32.48 35.98,31.72 U$25.9 | v38.57,53.51 v38.57,39.95
N$18
  Top 0.152: M1.1 49.85,24.25 49.85,25.62 U$69.27
PS0_3V  (via drill 0.35)
  Top 0.152: v37.2,30.8 37.3,30.8 39.95,33.44 v39.95,37.2 | v43.6,53.36 45.58,55.34 R15.1
  Bottom 0.152: v37.2,30.8 37.35,30.95 37.35,31.56 U$25.6 | v39.95,37.2 43.6,40.86 v43.6,53.36
PS1_3V  (via drill 0.35)
  Top 0.152: v34.92,30.04 34.92,27.45 32.93,25.47 32.93,14.8 32.33,14.19 R18.1
  Bottom 0.152: v34.92,30.04 37.35,30.04 37.81,30.5 37.81,32.17 37.51,32.48 U$25.5
SCL_3V
  Bottom 0.152: U$25.19 32.78,34 32.02,34 24.4,26.38 24.4,25.62 U$69.7
SDA_3V
  Bottom 0.152: U$25.20 32.93,34.92 32.93,35.07 34.46,36.59 41.24,36.59 42.38,35.45 42.38,32.17 36.9,26.69 28.06,26.69 26.99,25.62 U$69.8
VBAT  (via drill 0.35)
  Top 0.152: 32.02,53.97 33.7,53.97 37.66,50 37.66,46.04 37.35,45.74 37.2,45.74 36.44,44.97 R1.2 | 32.02,53.97 31.11,53.05 C1.1 30.95,52.9 v26.53,48.48 | 32.02,53.97 32.02,56.4 32.17,56.56 33.7,56.56 39.64,50.61 C4.1 | v21.96,8.25 22.27,7.94 22.27,7.64 U2.P$1 | v23.18,9.47 23.18,8.7 23.33,8.55 U2.P$20 | v14.34,15.87 12.67,15.87 U1.8 | v18.91,18.3 18.91,20.59 T1.E 18.91,20.74 18.91,23.64 18.3,24.25 18.3,29.43 13.12,34.61 13.12,45.13 12.51,45.74 | 12.51,45.74 10.68,45.74 10.07,45.13 9.16,45.13 R13.1 | v16.78,11.9 15.26,10.38 L1.P$1 | 12.51,45.74 v12.82,46.04
  Bottom 0.152: v23.18,9.47 v21.96,8.25 17.54,12.67 | 17.54,12.67 15.41,14.8 | 15.41,14.8 v14.34,15.87 | 15.41,14.8 v18.91,18.3 | 17.54,12.67 v16.78,11.9 | v26.53,48.48 15.26,48.48 v12.82,46.04
VBUS  (via drill 0.35)  (1 unrouted)
  Top 0.152: 24.1,8.55 24.25,8.55 U2.P$18 24.4,8.55 24.86,8.55 U2.P$17 | 24.1,8.55 23.94,8.55 U2.P$19 | U2.P$3 22.42,6.57 22.42,6.11 U2.P$4 22.27,6.11 v21.35,6.11 | v24.4,3.67 24.86,4.13 24.86,4.59 U2.P$9 | v24.1,9.47 24.1,8.55 | DONE.A 16.63,56.86 15.87,56.1 15.87,51.98 16.63,51.22 16.63,50.61 CHRG/LBO.A 16.78,50.46 20.59,46.65 20.59,25.47 22.72,23.33 v22.72,21.66 | C8.1 22.72,62.35 19.83,62.35 17.39,59.91 16.02,59.91 15.87,59.76 15.87,57.78 16.63,57.01 DONE.A | R6.2 32.78,58.08 31.87,59 25.62,59 25.31,58.69 21.2,58.69 19.52,57.01 16.78,57.01 DONE.A
  Bottom 0.152: v24.4,3.67 23.79,3.67 v21.35,6.11 24.1,8.86 v24.1,9.47 24.1,20.29 v22.72,21.66
VLIPO  (via drill 0.35)
  Top 0.152: U2.P$14 26.38,7.18 26.38,7.48 U2.P$15 | U2.P$15 26.23,7.64 25.47,8.4 U2.P$16 25.47,8.55 30.5,13.58 30.5,25.92 30.19,26.23 v30.19,37.81 | C7.1 22.11,59.91 v21.5,59.3 | v30.65,7.64 31.72,7.64 B1.2 | v27.3,7.64 26.38,7.64 U2.P$15
  Bottom 0.152: v21.5,59.3 21.5,59 35.83,44.67 35.83,43.6 32.93,40.71 32.93,40.4 30.34,37.81 v30.19,37.81 | v27.3,7.64 v30.65,7.64